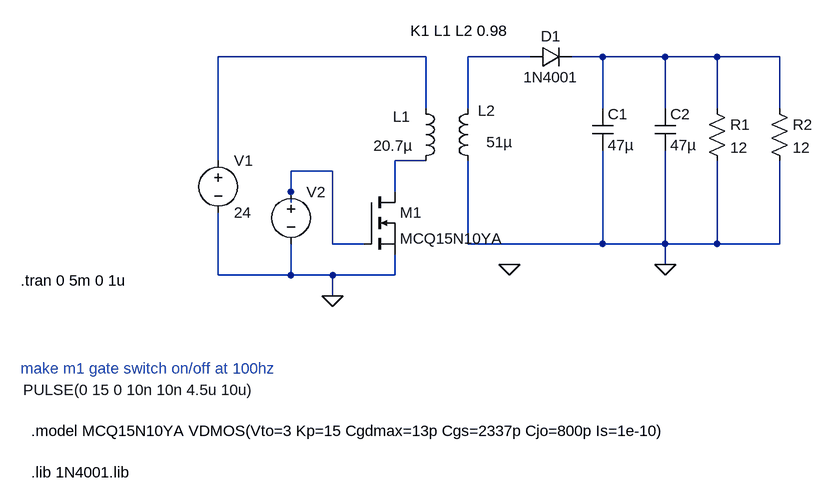
[diagram p0: schematic flyback.asc]
flyback.asc, the LTspice schematic file:
Version 4.1
SHEET 1 1064 680
WIRE 464 -64 144 -64
WIRE 624 -64 528 -64
WIRE 736 -64 688 -64
WIRE 832 -64 736 -64
WIRE 912 -64 832 -64
WIRE 1008 -64 912 -64
WIRE 464 16 464 -64
WIRE 528 16 528 -64
WIRE 736 16 736 -64
WIRE 832 16 832 -64
WIRE 912 16 912 -64
WIRE 1008 16 1008 -64
WIRE 144 96 144 -64
WIRE 464 96 416 96
WIRE 320 112 256 112
WIRE 256 144 256 112
WIRE 416 144 416 96
WIRE 256 160 256 144
WIRE 320 224 320 112
WIRE 368 224 320 224
WIRE 528 224 528 96
WIRE 736 224 736 80
WIRE 736 224 528 224
WIRE 832 224 832 80
WIRE 832 224 736 224
WIRE 912 224 912 96
WIRE 912 224 832 224
WIRE 1008 224 1008 96
WIRE 1008 224 912 224
WIRE 832 256 832 224
WIRE 144 272 144 176
WIRE 256 272 256 224
WIRE 256 272 144 272
WIRE 320 272 256 272
WIRE 416 272 416 240
WIRE 416 272 320 272
WIRE 320 304 320 272
FLAG 320 304 0
FLAG 832 256 0
FLAG 592 256 0
SYMBOL voltage 144 80 R0
SYMATTR InstName V1
SYMATTR Value 24
SYMBOL ind 448 112 M180
WINDOW 0 -35 84 Left 2
WINDOW 3 -65 39 Left 2
SYMATTR InstName L1
SYMATTR Value 20.7µ
SYMATTR Type ind
SYMATTR SpiceLine Rser=1m
SYMBOL ind 544 0 M0
WINDOW 0 -27 19 Left 2
WINDOW 3 -53 67 Left 2
SYMATTR InstName L2
SYMATTR Value 51µ
SYMATTR Type ind
SYMATTR SpiceLine Rser=1m
SYMBOL nmos 368 144 R0
SYMATTR InstName M1
SYMATTR Value MCQ15N10YA
SYMBOL diode 624 -48 R270
WINDOW 0 32 32 VTop 2
WINDOW 3 0 32 VBottom 2
SYMATTR InstName D1
SYMATTR Value 1N4001
SYMATTR Prefix X
SYMBOL voltage 256 128 R0
WINDOW 3 -412 321 Left 2
SYMATTR Value PULSE(0 15 0 10n 10n 4.5u 10u)
SYMATTR InstName V2
SYMBOL cap 720 16 R0
SYMATTR InstName C1
SYMATTR Value 47µ
SYMBOL cap 816 16 R0
SYMATTR InstName C2
SYMATTR Value 47µ
SYMBOL res 896 0 R0
SYMATTR InstName R1
SYMATTR Value 12
SYMBOL res 992 0 R0
SYMATTR InstName R2
SYMATTR Value 12
TEXT 440 -104 Left 2 !K1 L1 L2 0.98
TEXT -160 416 Left 2 ;make m1 gate switch on/off at 100hz
TEXT -160 280 Left 2 !.tran 0 5m 0 1u
TEXT -144 512 Left 2 !.model MCQ15N10YA VDMOS(Vto=3 Kp=15 Cgdmax=13p Cgs=2337p Cjo=800p Is=1e-10)
TEXT -144 576 Left 2 !.lib 1N4001.lib

The netlist it stands for:
* flyback.asc
V1 N001 0 24
L1 N004 N001 20.7µ Rser=1m
L2 N002 0 51µ Rser=1m
M1 N004 N005 0 0 MCQ15N10YA
X§D1 N002 N003 1N4001  ; pins + -
V2 N005 0 PULSE(0 15 0 10n 10n 4.5u 10u)
C1 N003 0 47µ
C2 N003 0 47µ
R1 N003 0 12
R2 N003 0 12
.model NMOS NMOS
.model PMOS PMOS
.lib standard.mos
K1 L1 L2 0.98
* make m1 gate switch on/off at 100hz
.tran 0 5m 0 1u
.model MCQ15N10YA VDMOS(Vto=3 Kp=15 Cgdmax=13p Cgs=2337p Cjo=800p Is=1e-10)
.lib 1N4001.lib
.backanno
.end